# EAGLE design imu_mk1 (EAGLE 8.4.0)
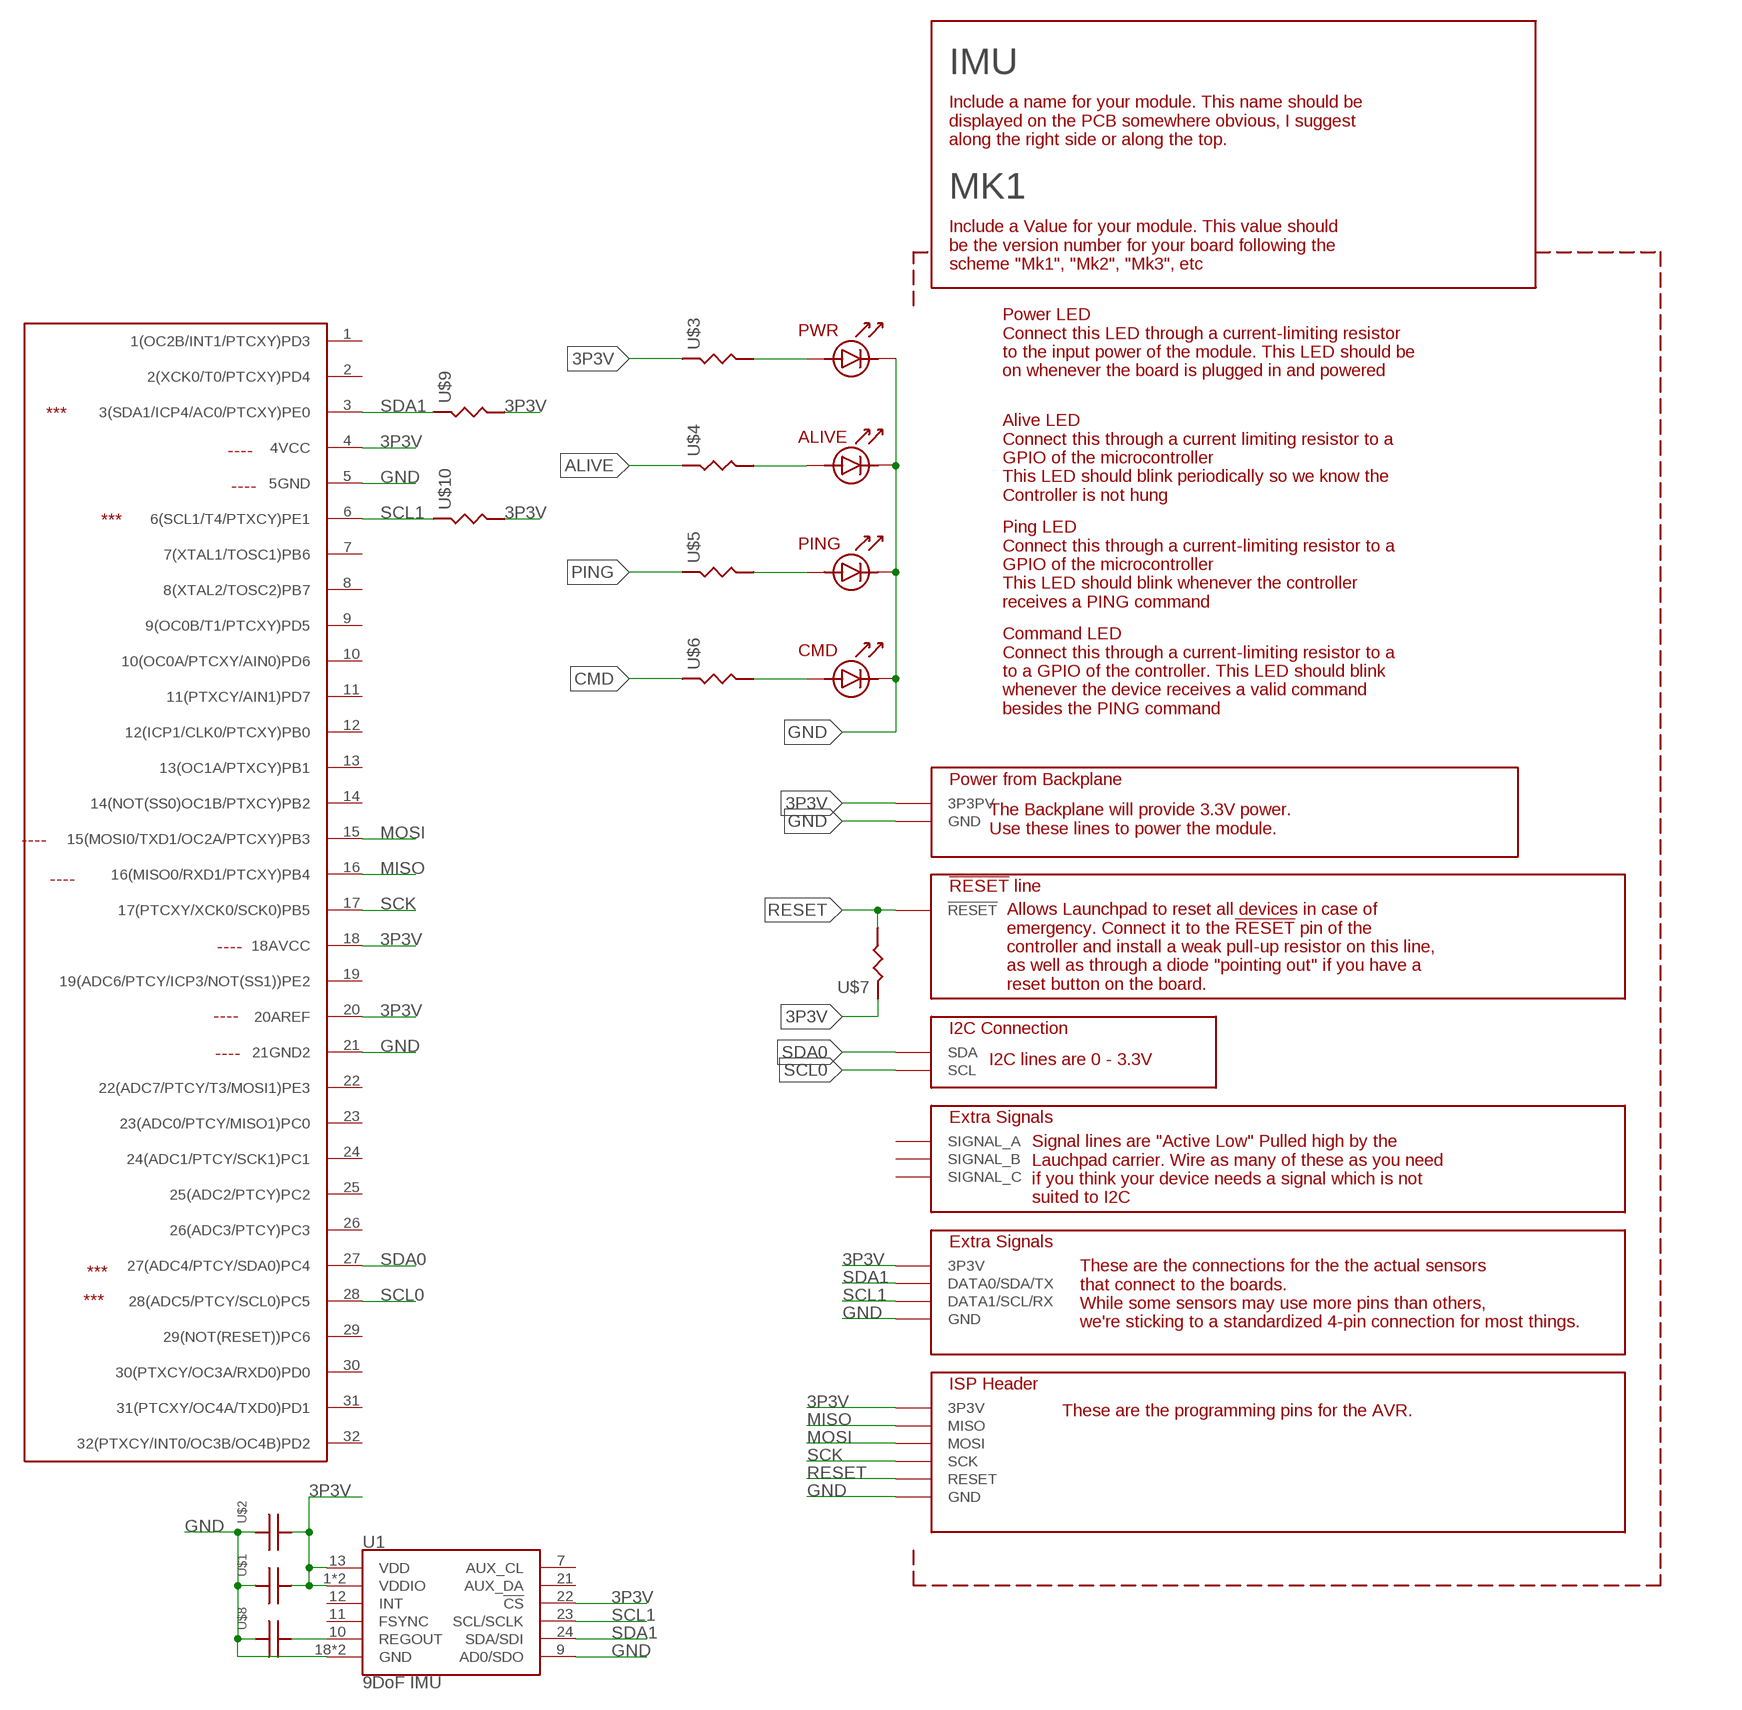
[diagram p0: schematic, sheet 1]

## Parts
IMU  MK1  SENSOR_MODULE_MK1  [SENSOR_MODULE_MK1]
U1  9DoF IMU  MPU-9250  [QFN24-3X3]
U100  ATMEGA328PB  [TQFP32-08]
U$1  CAPACITOR-UNPOLARIZED0805  [0805_STACKPOLERESISTOR]
U$2  CAPACITOR-UNPOLARIZED0805  [0805_STACKPOLERESISTOR]
U$3  RESISTOR  [0805_STACKPOLERESISTOR]
U$4  RESISTOR  [0805_STACKPOLERESISTOR]
U$5  RESISTOR  [0805_STACKPOLERESISTOR]
U$6  RESISTOR  [0805_STACKPOLERESISTOR]
U$7  RESISTOR  [0805_STACKPOLERESISTOR]
U$8  CAPACITOR-UNPOLARIZED0805  [0805_STACKPOLERESISTOR]
U$9  RESISTOR  [0805_STACKPOLERESISTOR]
U$10  RESISTOR  [0805_STACKPOLERESISTOR]

## Nets
3P3V: IMU.3P3V@1(3P3PV) IMU.3P3V@2(3P3V) IMU.3P3V@3(3P3V) IMU.3P3V@4(3P3V) U1.1(VDDIO) U1.8(VDDIO) U1.13(VDD) U1.22(!CS) U100.4(4VCC) U100.18(18AVCC) U100.20(20AREF) U$1.P$2 U$2.P$2 U$3.P$1 U$7.P$1 U$9.P$2 U$10.P$2
ALIVE: U$4.P$1
CMD: U$6.P$1
GND: IMU.ALIVELED_CATHODE IMU.CMDLED_CATHODE IMU.GND@1(GND) IMU.GND@2(GND) IMU.GND@3(GND) IMU.GND@4(GND) IMU.PINGLED_CATHODE IMU.PWRLED_CATHODE U1.9(AD0/SDO) U1.18(GND) U1.20(GND) U100.5(5GND) U100.21(21GND2) U$1.P$1 U$2.P$1 U$8.P$1
MISO: IMU.MISO U100.16(16(MISO0/RXD1/PTCXY)PB4)
MOSI: IMU.MOSI U100.15(15(MOSI0/TXD1/OC2A/PTCXY)PB3)
N$1: IMU.PWRLED_ANODE U$3.P$2
N$2: IMU.ALIVELED_ANODE U$4.P$2
N$3: IMU.PINGLED_ANODE U$5.P$2
N$4: IMU.CMDLED_ANODE U$6.P$2
PING: U$5.P$1
REGOUT: U1.10(REGOUT) U$8.P$2
RESET: IMU.RESET@1(!RESET) IMU.RESET@2(RESET) U$7.P$2
SCK: IMU.SCK U100.17(17(PTCXY/XCK0/SCK0)PB5)
SCL0: IMU.SCL U100.28(28(ADC5/PTCY/SCL0)PC5)
SCL1: IMU.DATA1@1(DATA1/SCL/RX) IMU.DATA1@2(DATA1/SCL/RX) U1.23(SCL/SCLK) U100.6(6(SCL1/T4/PTXCY)PE1) U$10.P$1
SDA0: IMU.SDA U100.27(27(ADC4/PTCY/SDA0)PC4)
SDA1: IMU.DATA0@1(DATA0/SDA/TX) IMU.DATA0@2(DATA0/SDA/TX) U1.24(SDA/SDI) U100.3(3(SDA1/ICP4/AC0/PTCXY)PE0) U$9.P$1
Unconnected: IMU.A(SIGNAL_A) IMU.B(SIGNAL_B) IMU.C(SIGNAL_C) U1.7(AUX_CL) U1.11(FSYNC) U1.12(INT) U1.21(AUX_DA) U100.1(1(OC2B/INT1/PTCXY)PD3) U100.2(2(XCK0/T0/PTCXY)PD4) U100.7(7(XTAL1/TOSC1)PB6) U100.8(8(XTAL2/TOSC2)PB7) U100.9(9(OC0B/T1/PTCXY)PD5) U100.10(10(OC0A/PTCXY/AIN0)PD6) U100.11(11(PTXCY/AIN1)PD7) U100.12(12(ICP1/CLK0/PTCXY)PB0) U100.13(13(OC1A/PTXCY)PB1) U100.14(14(NOT(SS0)OC1B/PTXCY)PB2) U100.19(19(ADC6/PTCY/ICP3/NOT(SS1))PE2) U100.22(22(ADC7/PTCY/T3/MOSI1)PE3) U100.23(23(ADC0/PTCY/MISO1)PC0) U100.24(24(ADC1/PTCY/SCK1)PC1) U100.25(25(ADC2/PTCY)PC2) U100.26(26(ADC3/PTCY)PC3) U100.29(29(NOT(RESET))PC6) U100.30(30(PTXCY/OC3A/RXD0)PD0) U100.31(31(PTCXY/OC4A/TXD0)PD1) U100.32(32(PTXCY/INT0/OC3B/OC4B)PD2)

## Library data of the parts
IMU = 000_CustomPartsMaster:SENSOR_MODULE_MK1
U1 = SparkFun-Sensors:MPU-9250: MPU-9250 9 Degree of Freedom IMU System in Package that contains MPU-6500 & AK8963 NC pin 19. 2-6 & 14-17 not internally connected. May be used for PCB trace routing. Datasheet <https://cdn.sparkfun.com/assets/learn_tutorials/5/5/0/MPU9250REV1.0.pdf> SparkFun Products: SparkFun 9DoF Razor IMU M0 <https://www.sparkfun.com/products/14001> SparkFun IMU Breakout - MPU-9250 <https://www.sparkfun.com/products/13762>; PROD_ID: IC-13192
U100 = StevenV1:ATMEGA328PB
U$1 U$2 U$8 = 000_CustomPartsMaster:CAPACITOR-UNPOLARIZED
U$3-U$7 U$9 U$10 = 000_CustomPartsMaster:RESISTOR

## Board
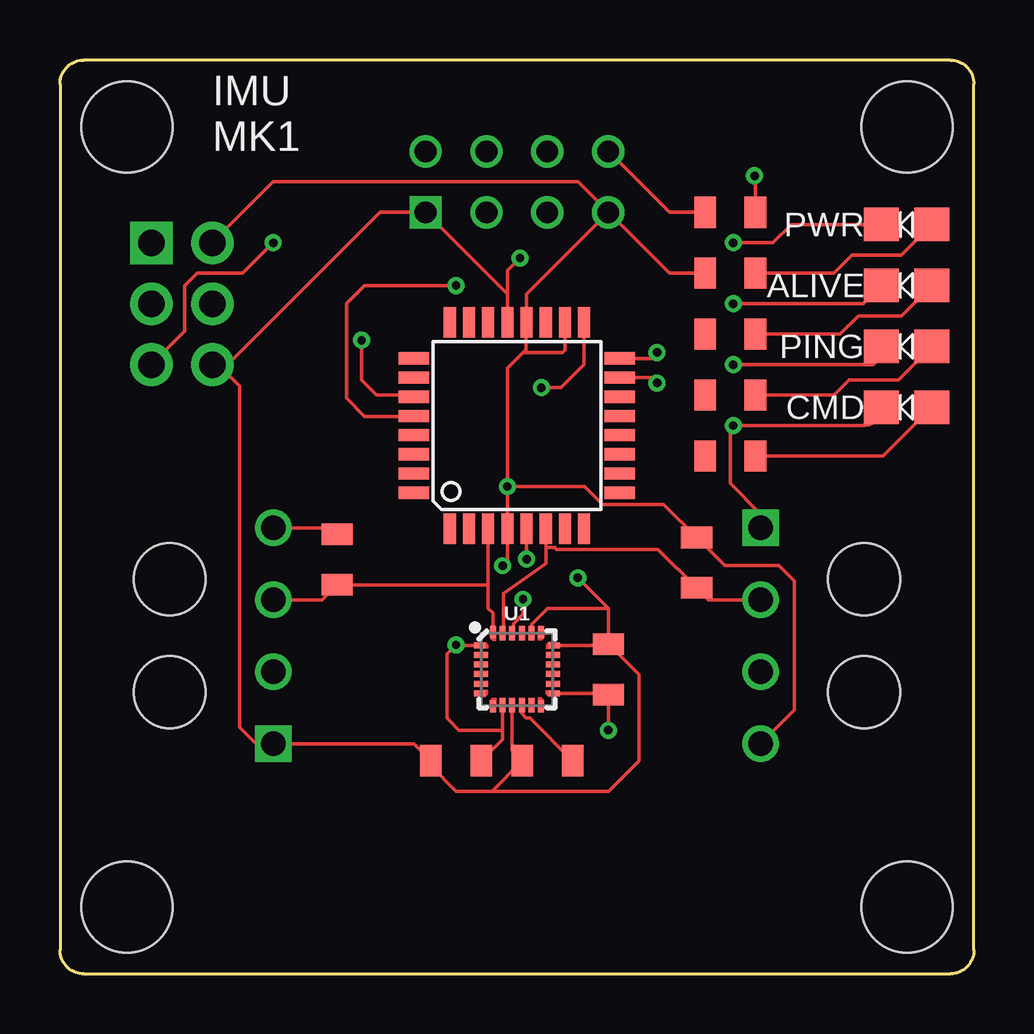
[diagram p1: board, top side]
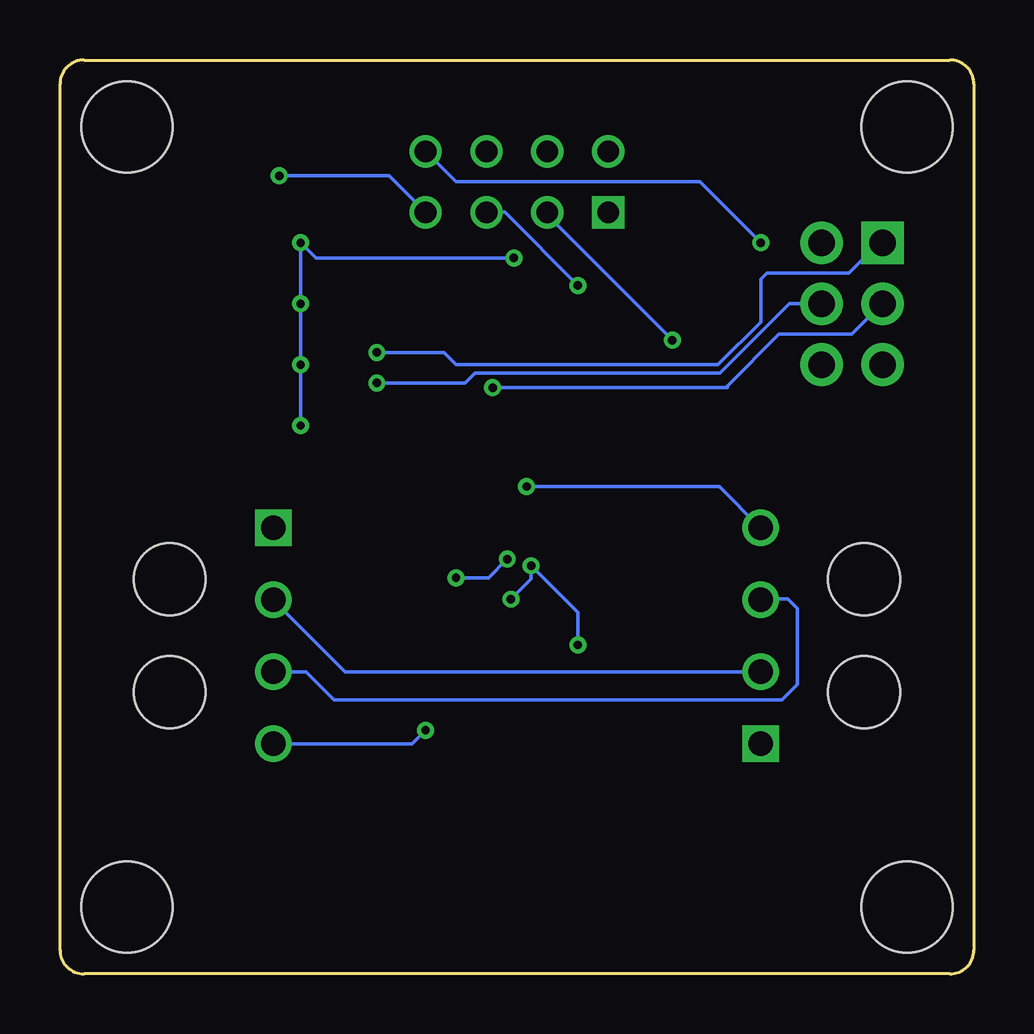
[diagram p2: board, bottom side, seen from below]

Size 38.1 x 38.1 mm. Coordinates in mm from the lower left corner, seen from the top.
Copper layers (1*16): Top 0.0356mm / dielectric 1.5011mm / Bottom 0.0356mm
Design rules "LaenPCBOrder": minimum track width 6mil, minimum drill 13mil, track to track 6mil, track to pad 6mil, pad to pad 6mil, via to via 6mil, smd to smd 6mil, copper to edge 15mil, drill to drill 6mil, minimum pad ring 7mil, minimum via ring 7mil, stop-mask expansion 3mil, vias tented up to drill 0mil, thermal gap 10mil

### Footprints (pad centres in the part's own frame; a part is rotated, then mirrored left to right if it is on the bottom)
SENSOR_MODULE_MK1 = drill 0.9: 3P3V@1 22.86,31.75; A 20.32,34.29; B 17.78,34.29; C 15.24,34.29; RESET@1 22.86,34.29; SCL 20.32,31.75; SDA 17.78,31.75 | drill 1.02: 3P3V@2 8.892,18.597; 3P3V@3 29.208,9.597; DATA0@1 8.892,15.597; DATA0@2 29.208,12.597; DATA1@1 8.892,12.597; DATA1@2 29.208,15.597 | drill 1.1 pad 1.778: 3P3V@4 6.35,30.48; GND@4 6.35,25.4; MOSI 6.35,27.94; RESET@2 3.81,25.4; SCK 3.81,27.94 | smd 1.45 x 1.4: ALIVELED_ANODE 36.343,28.702; ALIVELED_CATHODE 34.243,28.702; CMDLED_ANODE 36.343,23.622; CMDLED_CATHODE 34.243,23.622; PINGLED_ANODE 36.343,26.162; PINGLED_CATHODE 34.243,26.162; PWRLED_ANODE 36.343,31.242; PWRLED_CATHODE 34.243,31.242 | drill 0.9 square: GND@1 15.24,31.75 | drill 1.02 square: GND@2 8.892,9.597; GND@3 29.208,18.597 | drill 1.1 pad 1.778 square: MISO 3.81,30.48 | hole 3.797: 2.794,2.794; 35.306,2.794; 2.794,35.306; 35.306,35.306 | hole 3: 4.572,11.747; 4.572,16.447; 33.528,16.447; 33.528,11.747
QFN24-3X3 = smd 0.495 x 0.25: 1 -1.552,1; 6 -1.552,-1; 13 1.552,-1; 18 1.552,1 | smd 0.6 x 0.25: 2 -1.5,0.6; 3 -1.5,0.2; 4 -1.5,-0.2; 5 -1.5,-0.6; 14 1.5,-0.6; 15 1.5,-0.2; 16 1.5,0.2; 17 1.5,0.6 | smd 0.25 x 0.495: 7 -1,-1.552; 12 1,-1.552; 19 1,1.552; 24 -1,1.552 | smd 0.25 x 0.6: 8 -0.6,-1.5; 9 -0.2,-1.5; 10 0.2,-1.5; 11 0.6,-1.5; 20 0.6,1.5; 21 0.2,1.5; 22 -0.2,1.5; 23 -0.6,1.5
TQFP32-08 = smd 1.27 x 0.508: 1 -4.293,2.8; 2 -4.293,2; 3 -4.293,1.2; 4 -4.293,0.4; 5 -4.293,-0.4; 6 -4.293,-1.2; 7 -4.293,-2; 8 -4.293,-2.8; 17 4.293,-2.8; 18 4.293,-2; 19 4.293,-1.2; 20 4.293,-0.4; 21 4.293,0.4; 22 4.293,1.2; 23 4.293,2; 24 4.293,2.8 | smd 0.508 x 1.27: 9 -2.8,-4.293; 10 -2,-4.293; 11 -1.2,-4.293; 12 -0.4,-4.293; 13 0.4,-4.293; 14 1.2,-4.293; 15 2,-4.293; 16 2.8,-4.293; 25 2.8,4.293; 26 2,4.293; 27 1.2,4.293; 28 0.4,4.293; 29 -0.4,4.293; 30 -1.2,4.293; 31 -2,4.293; 32 -2.8,4.293
0805_STACKPOLERESISTOR = smd 0.9 x 1.3: P$1 -1.05,0; P$2 1.05,0

### Placement (x,y rotation side)
IMU  0,0 0 top
U1  19.05,12.7 0 top
U100  19.05,22.86 90 top
U$1  16.51,8.89 0 top
U$2  22.86,12.7 270 top
U$3  27.94,29.21 0 top
U$4  27.94,26.67 0 top
U$5  27.94,24.13 0 top
U$6  27.94,21.59 0 top
U$7  27.94,31.75 180 top
U$8  20.32,8.89 0 top
U$9  11.56,17.27 90 top
U$10  26.54,17.14 90 top

### Tracks (layer width: path | path; a pad name or v marks a point on that pad's centre or on a via)
3P3V  (via drill 0.35)
  Top 0.152: IMU.3P3V@1 19.45,28.34 U100.20 19.43,27.13 19.43,26.04 19.3,25.91 | IMU.3P3V@4 8.89,33.02 21.59,33.02 IMU.3P3V@1 | IMU.3P3V@1 25.4,29.21 U$3.P$1 | IMU.3P3V@2 11.28,18.6 U$9.P$2 | IMU.3P3V@3 30.61,11 30.61,16.38 29.97,17.02 27.72,17.02 U$10.P$2 25.16,19.58 22.61,19.58 21.87,20.32 v18.65,20.32 | v18.46,17.02 18.65,17.21 U100.4 v18.65,20.32 | U1.22 18.9,14.25 18.9,14.6 19.3,15 v19.3,15.62 | v18.65,20.32 18.65,25.25 19.3,25.91 | 19.3,25.91 20.95,25.91 21.05,26 U100.18 | U$7.P$1 28.99,33.24 v28.96,33.27 | 18.45,10.16 U1.8 | 18.45,10.16 18.45,9.78 U$1.P$2 | U1.13 22.81,11.7 U$2.P$2 v22.86,10.16 | 18.45,10.16 16.64,10.16 16.13,10.67 16.13,13.34 v16.51,13.72 16.53,13.7 U1.1
  Bottom 0.152: v19.3,15.62 18.46,16.47 v18.46,17.02 16.51,15.07 v16.51,13.72 | v28.96,33.27 24.38,33.27 IMU.3P3V@1 | IMU.3P3V@2 10.62,20.32 v18.65,20.32 | IMU.3P3V@3 23.42,9.6 v22.86,10.16
GND  (via drill 0.35)
  Top 0.152: U100.21 18.65,28.34 | 18.65,28.34 IMU.GND@1 13.34,31.75 6.99,25.4 6.6,25.4 | U1.9 18.85,9.31 U$8.P$1 18,7.62 | U1.18 22.81,13.7 U$2.P$1 | 18,7.62 16.51,7.62 15.46,8.67 U$1.P$1 14.75,9.6 IMU.GND@2 8.18,9.6 7.49,10.29 7.49,24.51 6.6,25.4 | 18,7.62 22.86,7.62 24.13,8.89 24.13,12.48 U$2.P$1 | 22.86,15.24 U$2.P$1 | 22.86,15.24 v21.59,16.51 | v19.45,17.29 U100.5 | 6.6,25.4 IMU.GND@4 | IMU.ALIVELED_CATHODE 33.48,27.94 v28.07,27.94 | v28.07,25.4 33.91,25.4 34.24,25.73 IMU.PINGLED_CATHODE | IMU.CMDLED_CATHODE arc-90 33.48,22.86 v28.07,22.86 27.94,22.73 27.94,20.45 29.21,19.18 IMU.GND@3 | IMU.PWRLED_CATHODE 30.48,31.24 29.72,30.48 v28.07,30.48 | 18.65,28.34 18.65,29.32 v19.18,29.84 | U1.20 19.65,14.57 20.32,15.24 22.86,15.24
  Bottom 0.152: v21.59,16.51 20.23,16.51 v19.45,17.29 | 28.07,27.81 v28.07,25.4 v28.07,22.86 | 28.07,27.81 v28.07,27.94 | 28.07,27.81 v28.07,30.48 27.43,29.84 v19.18,29.84
MISO  (via drill 0.35)
  Top 0.152: U100.16 24.64,25.66 v24.89,25.91
  Bottom 0.152: IMU.MISO 3.94,30.48 5.21,29.21 8.64,29.21 8.89,28.96 8.89,27.18 10.67,25.4 21.59,25.4 22.1,25.91 v24.89,25.91
MOSI  (via drill 0.35)
  Top 0.152: 23.25,24.77 U100.15 24.67,24.86 v24.89,24.64
  Bottom 0.152: IMU.MOSI 7.7,27.94 10.59,25.05 20.8,25.05 21.21,24.64 v24.89,24.64
N$1
  Top 0.152: U$3.P$2 32.26,29.21 33.02,29.97 35.07,29.97 IMU.PWRLED_ANODE
N$2
  Top 0.152: U$4.P$2 32.51,26.67 33.27,27.43 35.07,27.43 IMU.ALIVELED_ANODE
N$3
  Top 0.152: U$5.P$2 32.26,24.13 32.89,24.77 34.95,24.77 IMU.PINGLED_ANODE
N$4
  Top 0.152: U$6.P$2 34.31,21.59 IMU.CMDLED_ANODE
REGOUT
  Top 0.152: U$8.P$2 19.59,10.67 19.43,10.67 19.25,10.85 U1.10
RESET  (via drill 0.35)
  Top 0.152: IMU.RESET@1 25.4,31.75 U$7.P$2 | v8.89,30.48 7.62,29.21 5.71,29.21 5.21,28.7 5.21,26.8 IMU.RESET@2
  Bottom 0.152: IMU.RESET@1 21.59,33.02 11.43,33.02 v8.89,30.48
SCK  (via drill 0.35)
  Top 0.152: U100.17 21.84,25.4 20.88,24.44 v20.07,24.44
  Bottom 0.152: v20.07,24.44 10.29,24.44 10.29,24.51 8.13,26.67 5.08,26.67 IMU.SCK 4.32,27.94
SCL0  (via drill 0.35)
  Top 0.152: U100.28 14.74,23.24 12.7,23.24 11.94,24 11.94,27.94 12.7,28.7 v16.51,28.7
  Bottom 0.152: v16.51,28.7 19.56,31.75 IMU.SCL
SCL1
  Top 0.152: IMU.DATA1@2 27.04,15.6 U$10.P$1 24.93,17.7 20.7,17.7 20.62,17.78 20.25,17.78 | U1.23 18.5,14.25 18.5,15.87 20.25,17.11 20.25,17.78 | U100.6 20.25,17.78
  Bottom 0.152: IMU.DATA1@1 26.21,12.6 IMU.DATA1@2
SDA0  (via drill 0.35)
  Top 0.152: U100.27 14.69,24.13 13.21,24.13 12.57,24.77 v12.57,26.42
  Bottom 0.152: v12.57,26.42 17.78,31.62 IMU.SDA
SDA1
  Top 0.152: 17.85,16.26 U100.3 | 17.85,16.26 17.85,15.24 18.05,15.04 U1.24 | 17.85,16.26 17.82,16.22 U$9.P$1 10.93,15.6 IMU.DATA0@1
  Bottom 0.152: IMU.DATA0@2 27.84,12.6 26.67,11.43 8,11.43 7.37,12.06 7.37,15.24 7.75,15.62 8.87,15.62 IMU.DATA0@1